# EAGLE design C1LabsBlinky (EAGLE 6.6.0)
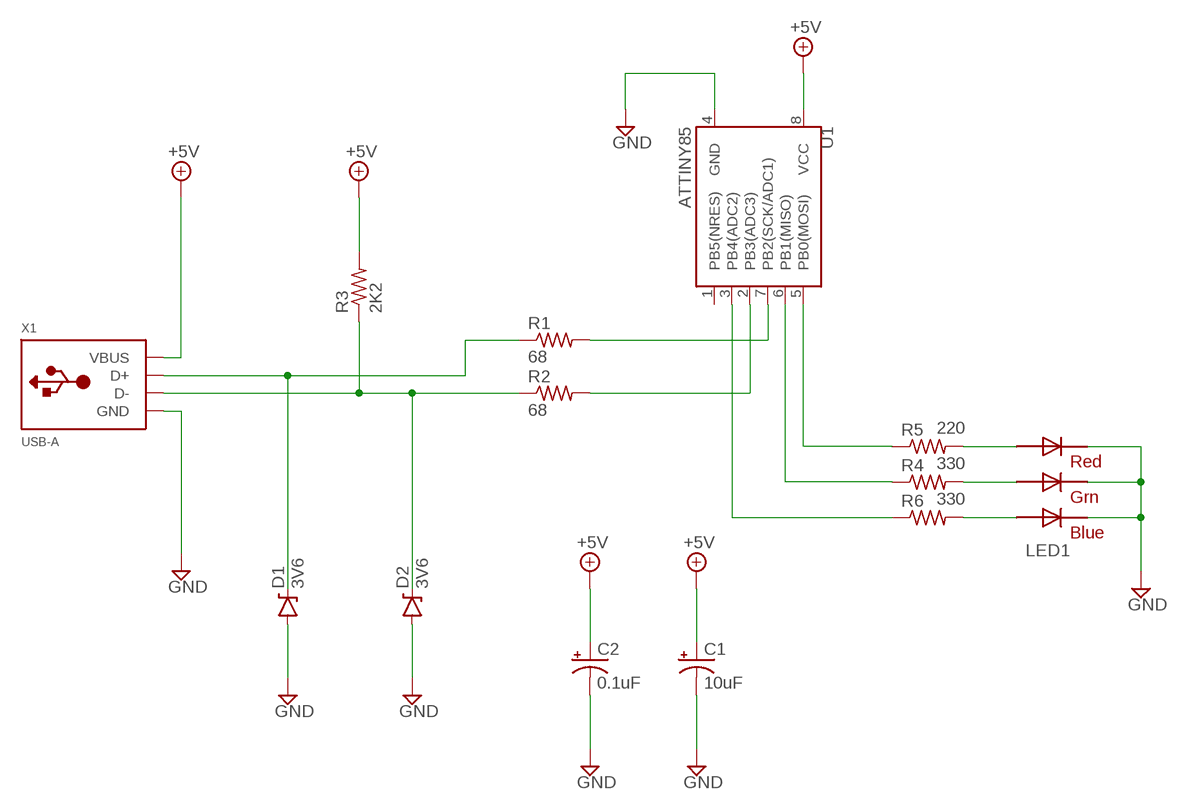
[diagram p0: schematic, sheet 1]

## Parts
C1  10uF  CAP_POLPTH2  [CPOL-RADIAL-10UF-25V]
C2  0.1uF  CPOL-USTT2D5  [TT2D5]
D1  3V6  DIODE-ZENERPTH  [DIODE-ZENER]
D2  3V6  DIODE-ZENERPTH  [DIODE-ZENER]
LED1  RGBLED5050  [RGBLED5050]
R1  68  R-US_0207/10  [0207/10]
R2  68  R-US_0207/10  [0207/10]
R3  2K2  R-US_0207/10  [0207/10]
R4  330  R-US_0207/10  [0207/10]
R5  220  R-US_0207/10  [0207/10]
R6  330  R-US_0207/10  [0207/10]
U1  ATTINY85  ATTINY45TINY85-20-DIP  [DIP08]
X1  USB-A  [MOLEX_480371000]

## Nets
+5V: C1.1(+) C2.+ R3.2 U1.8(VCC) X1.1(VBUS)
GND: C1.2(-) C2.- D1.P$2(A) D2.P$2(A) LED1.4(BLUE_C) LED1.5(RED_C) LED1.6(GREEN_C) U1.4(GND) X1.4(GND)
N$1: D1.P$1(C) R1.1 X1.3(D+)
N$2: D2.P$1(C) R2.1 R3.1 X1.2(D-)
N$3: LED1.2(RED_A) R5.2
N$4: LED1.1(GREEN_A) R4.2
N$5: LED1.3(BLUE_A) R6.2
N$6: R5.1 U1.5(PB0(MOSI))
N$7: R1.2 U1.7(PB2(SCK/ADC1))
N$8: R4.1 U1.6(PB1(MISO))
N$9: R2.2 U1.2(PB3(ADC3))
N$10: R6.1 U1.3(PB4(ADC2))
Unconnected: U1.1(PB5(NRES))

## Library data of the parts
C1 = SparkFun-Passives:CAP_POL: Capacitor Polarized These are standard SMD and PTH capacitors. Normally 10uF, 47uF, and 100uF in electrolytic and tantalum varieties. Always verify the external diameter of the through hole cap, it varies with capacity, voltage, and manufacturer. The EIA devices should be standard.
C2 = rcl:CPOL-US: POLARIZED CAPACITOR, American symbol
D1 D2 = SparkFun-DiscreteSemi:DIODE-ZENER: Zener Diode Production Part - 8199 3.4V Zener Voltage
LED1 = adafruit:RGBLED: For 5050 RGB LEDs, the order of the LEDs may vary from one manufacturer to another!
R1-R6 = adafruit:R-US_: RESISTOR, American symbol
U1 = SparkFun-DigitalIC:ATTINY45: Atmel 8-pin 2/4/8kB flash uC; PROD_ID: IC-09445; VALUE: TINY85-20-DIP
X1 = adafruit:USB-A: USB type A 'plug' Used for things that can directly connect to a USB port, say USB key

## Board
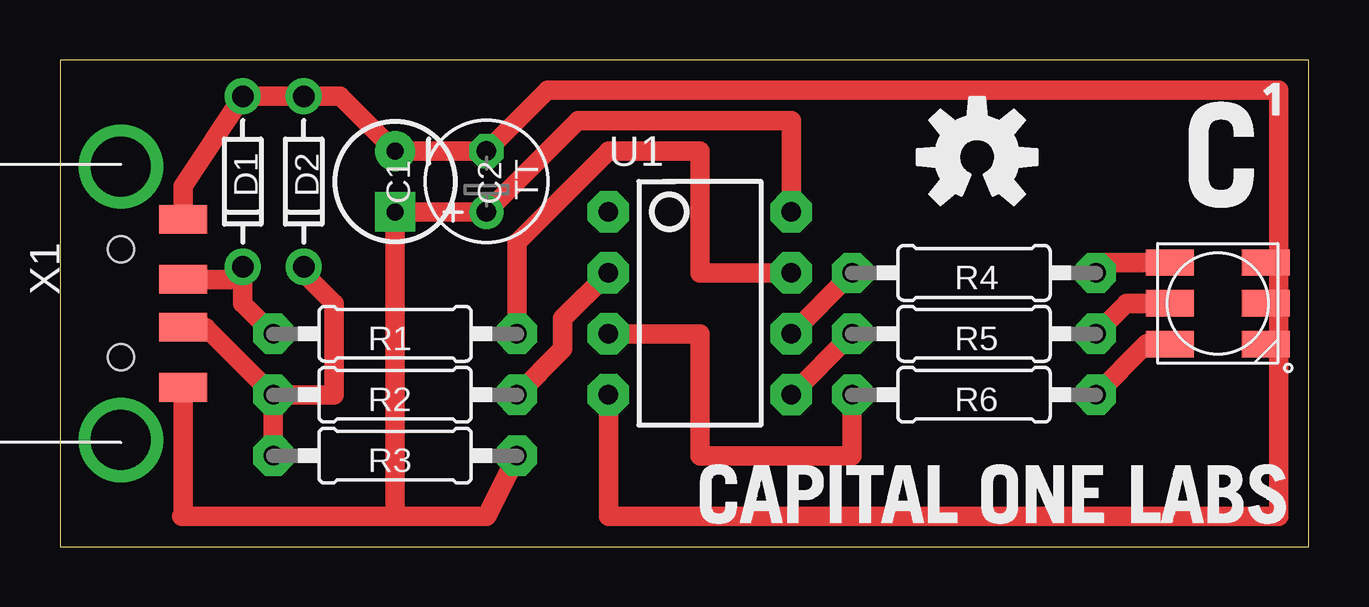
[diagram p1: board, top side]

Size 52.06 x 20.31 mm. Coordinates in mm from the lower left corner, seen from the top.
Outline: 0,0 52.06,0 52.06,20.31 0,20.31 0,0
Copper layers (1*16): Top 0.035mm / dielectric 1.5mm / Bottom 0.035mm
Design rules "SparkFun": minimum track width 8mil, minimum drill 20mil, track to track 8mil, track to pad 8mil, pad to pad 8mil, via to via 8mil, smd to smd 8mil, copper to edge 10mil, drill to drill 8mil, minimum pad ring 12mil, minimum via ring 10mil, stop-mask expansion 4mil, vias tented up to drill 25mil, thermal gap 10mil

### Footprints (pad centres in the part's own frame; a part is rotated, then mirrored left to right if it is on the bottom)
CPOL-RADIAL-10UF-25V = drill 0.7 pad 1.651 square: 1 1.27,0 | drill 0.7 pad 1.651: 2 -1.27,0
TT2D5 = drill 0.813: + -1.27,0 | drill 0.813 octagon: - 1.27,0
DIODE-ZENER = drill 0.9: P$1 -3.556,0; P$2 3.556,0
RGBLED5050 = smd 2 x 1.1: 1 -2,1.7; 2 -2,0; 3 -2,-1.7; 4 2,-1.7; 5 2,0; 6 2,1.7
0207/10 = drill 0.813 pad 1.676 octagon: 1 -5.08,0; 2 5.08,0
DIP08 = drill 0.813 pad 1.727 octagon: 1 -3.81,-3.81; 2 -1.27,-3.81; 3 1.27,-3.81; 4 3.81,-3.81; 5 3.81,3.81; 6 1.27,3.81; 7 -1.27,3.81; 8 -3.81,3.81
MOLEX_480371000 = smd 1.2 x 2: 1 3.5,2.6; 2 1,2.6; 3 -1,2.6; 4 -3.5,2.6 | drill 2.5: M1 -5.7,0; M2 5.7,0 | hole 1.1: -2.25,0; 2.25,0

### Placement (x,y rotation side)
C1  13.97,15.24 270 top
C2  17.78,15.24 90 top
D1  7.62,15.24 90 top
D2  10.16,15.24 90 top
LED1  48.26,10.16 0 top
R1  13.97,8.89 0 top
R2  13.97,6.35 0 top
R3  13.97,3.81 0 top
R4  38.1,11.43 0 top
R5  38.1,8.89 0 top
R6  38.1,6.35 0 top
U1  26.67,10.16 270 top
U$1  [C1_LABS_NAME_POS]  26.06,0.53 0 top
U$2  [OSHW-LOGO-M]  38.23,16.26 0 top
U$3  [C1_LABS_LOGO_S]  45.34,13.77 0 top
X1  2.54,10.16 270 top

### Tracks (layer width: path | path; a pad name or v marks a point on that pad's centre or on a via)
+5V
  Top 0.813: 13.97,1.27 C1.1 C2.+ 21.59,17.78 30.48,17.78 U1.8 | 13.97,1.27 17.78,1.27 R3.2 | X1.1 5.14,1.33 5.08,1.27 13.97,1.27
GND
  Top 0.813: X1.4 5.14,15.05 D1.P$2 D2.P$2 11.68,18.8 C1.2 C2.- 20.32,19.05 50.8,19.05 50.8,11.86 | U1.4 22.86,1.27 50.8,1.27 50.8,8.46 | 50.8,11.86 50.8,10.16 | 50.8,10.16 50.8,8.46 | LED1.4 50.8,8.46 | LED1.6 50.8,11.86 | LED1.5 50.8,10.16
N$1
  Top 0.813: X1.3 7.1,11.16 D1.P$1 7.62,10.16 R1.1
N$2
  Top 0.813: D2.P$1 10.16,11.43 11.43,10.16 11.43,6.35 R2.1 | R2.1 R3.1 | X1.2 6.08,9.16 R2.1
N$3
  Top 0.813: R5.2 44.45,10.16 LED1.2
N$4
  Top 0.813: R4.2 43.61,11.86 LED1.1
N$5
  Top 0.813: R6.2 45.29,8.46 LED1.3
N$6
  Top 0.813: U1.5 R5.1
N$7
  Top 0.813: R1.2 19.05,12.7 22.86,16.51 26.67,16.51 26.67,11.43 U1.7
N$8
  Top 0.813: U1.6 R4.1
N$9
  Top 0.813: R2.2 20.95,8.26 20.95,9.53 U1.2
N$10
  Top 0.813: U1.3 26.67,8.89 26.67,3.81 33.02,3.81 R6.1